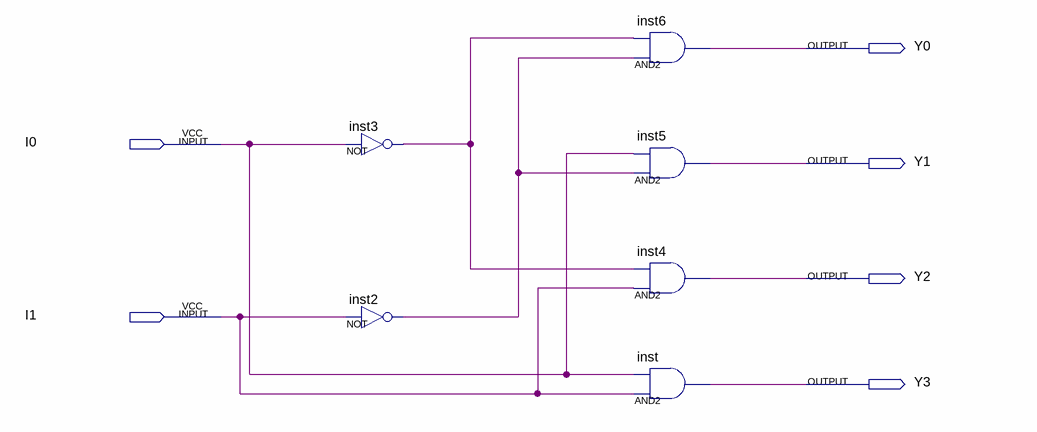
[diagram p0: schematic sheet]
// Quartus schematic 2-4.bdf as structural Verilog: 6 symbols, 6 pins
module \2-4  (
  input  I0,
  input  I1,
  output Y0,
  output Y1,
  output Y2,
  output Y3
);

  wire inst2_out, inst3_out;

  not inst3 (inst3_out, I0);
  not inst2 (inst2_out, I1);
  and inst6 (Y0, inst2_out, inst3_out);
  and inst5 (Y1, inst2_out, I0);
  and inst4 (Y2, I1, inst3_out);
  and inst (Y3, I1, I0);
endmodule
